# EAGLE schematic Odbiornik_1 (EAGLE 9.0.1)
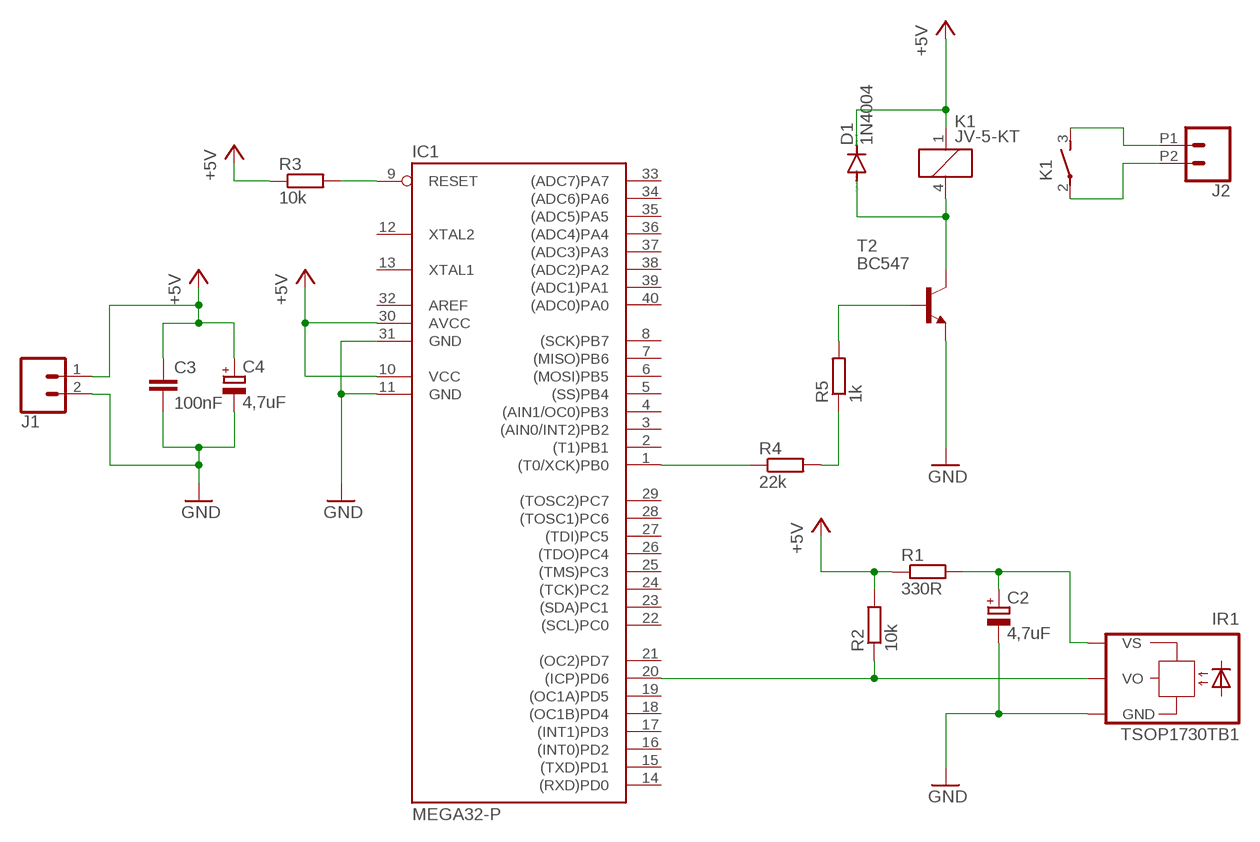
[diagram p0: schematic, sheet 1]

## Parts
C2  4,7uF  CPOL-EUE2-4  [E2-4]
C3  100nF  C-EU025-024X044  [C025-024X044]
C4  4,7uF  CPOL-EUE2-4  [E2-4]
D1  1N4004  [DO41-10]
IC1  MEGA32-P  [DIL40]
IR1  TSOP1730TB1  [TSOP17_TB1]
J1  CONN_02  [1X02]
J2  CONN_022.54MM_SCREWTERM  [1X02_2.54_SCREWTERM]
K1  JV-5-KT  [JV-KT]
R1  330R  R-EU_0204/5  [0204/5]
R2  10k  R-EU_0204/5  [0204/5]
R3  10k  R-EU_0204/5  [0204/5]
R4  22k  R-EU_0204/5  [0204/5]
R5  1k  R-EU_0204/5  [0204/5]
T2  BC547  [TO92]

## Nets
+5V: C3.1 C4.+ D1.C IC1.10(VCC) IC1.30(AVCC) J1.1 K1.1 R1.1 R2.2 R3.1
GND: C2.- C3.2 C4.- IC1.11(GND) IC1.31(GND) IR1.GND J1.2 T2.1(E)
N$1: IC1.20((ICP)PD6) IR1.VO R2.1
N$2: C2.+ IR1.VS R1.2
N$3: IC1.9(RESET) R3.2
N$4: IC1.1((T0/XCK)PB0) R4.1
N$5: R4.2 R5.1
N$6: D1.A K1.4 T2.3(C)
N$7: J2.P1 K1.3(S)
N$8: J2.P2 K1.2(P)
N$9: R5.2 T2.2(B)
Unconnected: IC1.2((T1)PB1) IC1.3((AIN0/INT2)PB2) IC1.4((AIN1/OC0)PB3) IC1.5((SS)PB4) IC1.6((MOSI)PB5) IC1.7((MISO)PB6) IC1.8((SCK)PB7) IC1.12(XTAL2) IC1.13(XTAL1) IC1.14((RXD)PD0) IC1.15((TXD)PD1) IC1.16((INT0)PD2) IC1.17((INT1)PD3) IC1.18((OC1B)PD4) IC1.19((OC1A)PD5) IC1.21((OC2)PD7) IC1.22((SCL)PC0) IC1.23((SDA)PC1) IC1.24((TCK)PC2) IC1.25((TMS)PC3) IC1.26((TDO)PC4) IC1.27((TDI)PC5) IC1.28((TOSC1)PC6) IC1.29((TOSC2)PC7) IC1.32(AREF) IC1.33((ADC7)PA7) IC1.34((ADC6)PA6) IC1.35((ADC5)PA5) IC1.36((ADC4)PA4) IC1.37((ADC3)PA3) IC1.38((ADC2)PA2) IC1.39((ADC1)PA1) IC1.40((ADC0)PA0)

## Library data of the parts
C2 C4 = resistor:CPOL-EU: POLARIZED CAPACITOR, European symbol
C3 = resistor:C-EU: CAPACITOR, European symbol
D1 = diode:1N4004: DIODE general purpose rectifier, 1 A
IC1 = atmel:MEGA32-P: MICROCONTROLLER 32 Kbytes FLASH 2 Kbytes SRAM 1 Kbytes EEPROM USART 8-channel 10 bit ADC Source: www.atmel.com .. doc2503.pdf; MPN: ATMEGA32-16PU; OC_FARNELL: 1661729; OC_NEWARK: 51P1794
IR1 = telefunken:TSOP17*TB1: TSOP17..TB1 IR Receiver Modules for Remote Control Systems Source: http://www.vishay.com/docs/82042/82042.pdf; OC_FARNELL: unknown; OC_NEWARK: unknown
J1 J2 = SparkFun-Connectors:CONN_02: Multi connection point. Often used as Generic Header-pin footprint for 0.1 inch spaced/style header connections On any of the 0.1 inch spaced packages, you can populate with these: Break Away Headers - Straight <https://www.sparkfun.com/products/116> (PRT-00116) Break Away Male Headers - Right Angle <https://www.sparkfun.com/products/553> (PRT-00553) Female Headers <https://www.sparkfun.com/products/115> (PRT-00115) Break Away Headers - Machine Pin <https://www.sparkfun.com/products/117> (PRT-00117) Break Away Female Headers - Swiss Machine Pin <https://www.sparkfun.com/products/743> (PRT-00743) For SCREWTERMINALS and SPRING TERMINALS visit here: Screw Terimnals on SparkFun.com <https://www.sparkfun.com/search/results?term=Screw+Terminals> (5mm/3.5mm/2.54mm spacing) This device is also useful as a general connection point to wire up your design to another part of your project. Our various solder wires solder well into these plated through hole pads. Hook-Up Wire - Assortment (Stranded, 22 AWG) <https://www.sparkfun.com/products/11375> (PRT-11375) Hook-Up Wire - Assortment (Solid Core, 22 AWG) <https://www.sparkfun.com/products/11367> (PRT-11367) View the entire wire category on our website here <https://www.sparkfun.com/categories/141> Special notes: Molex polarized connector foot print use with: PRT-08233 with associated crimp pins and housings. 2.54_SCREWTERM for use with PRT-10571. 3.5mm Screw Terminal footprints for PRT-08084 5mm Screw Terminal footprints for use with PRT-08432
K1 = relay:JV*-KT: POWER RELAY JV SERIES 1 POLE—5 A (MEDIUM LOAD CONTROL) Source: Data sheet <http://www.produktinfo.conrad.com/datenblaetter/500000-524999/502946-da-01-en-RELAIS_JV_12S_KT.pdf>
R1-R5 = resistor:R-EU_: RESISTOR, European symbol
T2 = transistor:BC547: NPN TRANSISTOR